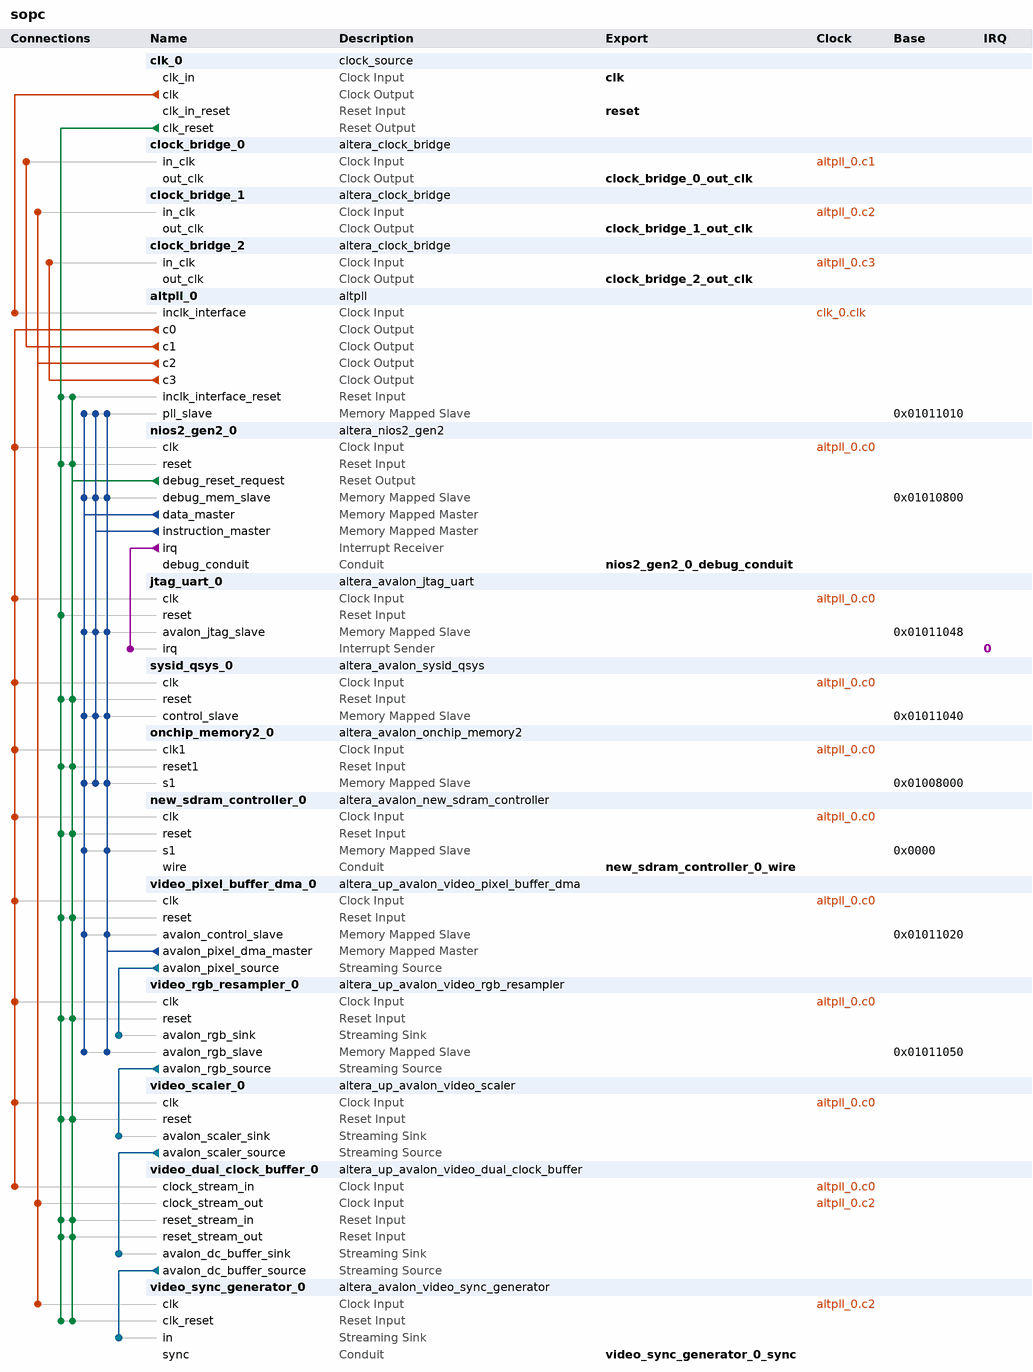
[diagram p0: system contents]
# Platform Designer (Qsys) system sopc, Cyclone 10 LP 10CL025YE144I7G
# Parameters at their usual value, and those the tool derives, are not listed.
package require -exact qsys 18.1
create_system sopc
set_project_property DEVICE_FAMILY {Cyclone 10 LP}
set_project_property DEVICE 10CL025YE144I7G

add_instance clk_0 clock_source 18.1
set_instance_parameter_value clk_0 clockFrequency 50000000
set_instance_parameter_value clk_0 resetSynchronousEdges BOTH

add_instance clock_bridge_0 altera_clock_bridge 18.1
set_instance_parameter_value clock_bridge_0 DERIVED_CLOCK_RATE 120000000
set_instance_parameter_value clock_bridge_0 EXPLICIT_CLOCK_RATE 0

add_instance clock_bridge_1 altera_clock_bridge 18.1
set_instance_parameter_value clock_bridge_1 DERIVED_CLOCK_RATE 40000000
set_instance_parameter_value clock_bridge_1 EXPLICIT_CLOCK_RATE 0

add_instance clock_bridge_2 altera_clock_bridge 18.1
set_instance_parameter_value clock_bridge_2 DERIVED_CLOCK_RATE 200000000
set_instance_parameter_value clock_bridge_2 EXPLICIT_CLOCK_RATE 0

add_instance altpll_0 altpll 18.1
set_instance_parameter_value altpll_0 CLK0_DIVIDE_BY 5
set_instance_parameter_value altpll_0 CLK0_MULTIPLY_BY 12
set_instance_parameter_value altpll_0 CLK1_DIVIDE_BY 5
set_instance_parameter_value altpll_0 CLK1_DUTY_CYCLE 50
set_instance_parameter_value altpll_0 CLK1_MULTIPLY_BY 12
set_instance_parameter_value altpll_0 CLK1_PHASE_SHIFT -1389
set_instance_parameter_value altpll_0 CLK2_DIVIDE_BY 5
set_instance_parameter_value altpll_0 CLK2_DUTY_CYCLE 50
set_instance_parameter_value altpll_0 CLK2_MULTIPLY_BY 4
set_instance_parameter_value altpll_0 CLK2_PHASE_SHIFT 0
set_instance_parameter_value altpll_0 CLK3_DIVIDE_BY 1
set_instance_parameter_value altpll_0 CLK3_DUTY_CYCLE 50
set_instance_parameter_value altpll_0 CLK3_MULTIPLY_BY 4
set_instance_parameter_value altpll_0 CLK3_PHASE_SHIFT 0
set_instance_parameter_value altpll_0 INCLK0_INPUT_FREQUENCY 20000
set_instance_parameter_value altpll_0 PORT_ARESET PORT_UNUSED
set_instance_parameter_value altpll_0 PORT_LOCKED PORT_UNUSED
set_instance_parameter_value altpll_0 PORT_clk1 PORT_USED
set_instance_parameter_value altpll_0 PORT_clk2 PORT_USED
set_instance_parameter_value altpll_0 PORT_clk3 PORT_USED

add_instance nios2_gen2_0 altera_nios2_gen2 18.1
set_instance_parameter_value nios2_gen2_0 dcache_size 0
set_instance_parameter_value nios2_gen2_0 debug_debugReqSignals true
set_instance_parameter_value nios2_gen2_0 exceptionSlave onchip_memory2_0.s1
set_instance_parameter_value nios2_gen2_0 icache_size 0
set_instance_parameter_value nios2_gen2_0 impl Fast
set_instance_parameter_value nios2_gen2_0 mmu_TLBMissExcOffset 64
set_instance_parameter_value nios2_gen2_0 mmu_TLBMissExcSlave nios2_gen2_0.debug_mem_slave
set_instance_parameter_value nios2_gen2_0 mmu_autoAssignTlbPtrSz false
set_instance_parameter_value nios2_gen2_0 resetSlave onchip_memory2_0.s1
set_instance_parameter_value nios2_gen2_0 setting_support31bitdcachebypass false

add_instance jtag_uart_0 altera_avalon_jtag_uart 18.1
set_instance_parameter_value jtag_uart_0 simInteractiveOptions NO_INTERACTIVE_WINDOWS

add_instance sysid_qsys_0 altera_avalon_sysid_qsys 18.1
set_instance_parameter_value sysid_qsys_0 id 305419896

add_instance onchip_memory2_0 altera_avalon_onchip_memory2 18.1
set_instance_parameter_value onchip_memory2_0 dataWidth 32
set_instance_parameter_value onchip_memory2_0 dualPort false
set_instance_parameter_value onchip_memory2_0 initMemContent true
set_instance_parameter_value onchip_memory2_0 initializationFileName onchip_mem.hex
set_instance_parameter_value onchip_memory2_0 memorySize 32000

add_instance new_sdram_controller_0 altera_avalon_new_sdram_controller 18.1
set_instance_parameter_value new_sdram_controller_0 TAC 5.5
set_instance_parameter_value new_sdram_controller_0 TRCD 20.0
set_instance_parameter_value new_sdram_controller_0 TRP 20.0
set_instance_parameter_value new_sdram_controller_0 casLatency 2
set_instance_parameter_value new_sdram_controller_0 columnWidth 10
set_instance_parameter_value new_sdram_controller_0 dataWidth 8
set_instance_parameter_value new_sdram_controller_0 generateSimulationModel false
set_instance_parameter_value new_sdram_controller_0 initRefreshCommands 8
set_instance_parameter_value new_sdram_controller_0 model single_Micron_MT48LC4M32B2_7_chip
set_instance_parameter_value new_sdram_controller_0 numberOfBanks 4
set_instance_parameter_value new_sdram_controller_0 numberOfChipSelects 1
set_instance_parameter_value new_sdram_controller_0 powerUpDelay 200.0
set_instance_parameter_value new_sdram_controller_0 refreshPeriod 7.8125
set_instance_parameter_value new_sdram_controller_0 rowWidth 12

add_instance video_pixel_buffer_dma_0 altera_up_avalon_video_pixel_buffer_dma 18.0
set_instance_parameter_value video_pixel_buffer_dma_0 addr_mode X-Y
set_instance_parameter_value video_pixel_buffer_dma_0 back_start_address 1048576
set_instance_parameter_value video_pixel_buffer_dma_0 color_space {16-bit RGB}
set_instance_parameter_value video_pixel_buffer_dma_0 image_height 300
set_instance_parameter_value video_pixel_buffer_dma_0 image_width 400
set_instance_parameter_value video_pixel_buffer_dma_0 start_address 0

add_instance video_rgb_resampler_0 altera_up_avalon_video_rgb_resampler 18.0
set_instance_parameter_value video_rgb_resampler_0 alpha 255
set_instance_parameter_value video_rgb_resampler_0 input_type {16-bit RGB}
set_instance_parameter_value video_rgb_resampler_0 output_type {8-bit RGB}

add_instance video_scaler_0 altera_up_avalon_video_scaler 18.0
set_instance_parameter_value video_scaler_0 color_bits 8
set_instance_parameter_value video_scaler_0 color_planes 1
set_instance_parameter_value video_scaler_0 height_in 300
set_instance_parameter_value video_scaler_0 height_scaling 2
set_instance_parameter_value video_scaler_0 width_in 400
set_instance_parameter_value video_scaler_0 width_scaling 2

add_instance video_dual_clock_buffer_0 altera_up_avalon_video_dual_clock_buffer 18.0
set_instance_parameter_value video_dual_clock_buffer_0 color_bits 8
set_instance_parameter_value video_dual_clock_buffer_0 color_planes 1

add_instance video_sync_generator_0 altera_avalon_video_sync_generator 18.1
set_instance_parameter_value video_sync_generator_0 BEATS_PER_PIXEL 1
set_instance_parameter_value video_sync_generator_0 DATA_STREAM_BIT_WIDTH 8
set_instance_parameter_value video_sync_generator_0 H_BLANK_PIXELS 0
set_instance_parameter_value video_sync_generator_0 H_FRONT_PORCH_PIXELS 0
set_instance_parameter_value video_sync_generator_0 H_SYNC_PULSE_PIXELS 256
set_instance_parameter_value video_sync_generator_0 H_SYNC_PULSE_POLARITY 0
set_instance_parameter_value video_sync_generator_0 NUM_COLUMNS 800
set_instance_parameter_value video_sync_generator_0 NUM_ROWS 600
set_instance_parameter_value video_sync_generator_0 TOTAL_HSCAN_PIXELS 1056
set_instance_parameter_value video_sync_generator_0 TOTAL_VSCAN_LINES 628
set_instance_parameter_value video_sync_generator_0 V_BLANK_LINES 0
set_instance_parameter_value video_sync_generator_0 V_FRONT_PORCH_LINES 0
set_instance_parameter_value video_sync_generator_0 V_SYNC_PULSE_LINES 28
set_instance_parameter_value video_sync_generator_0 V_SYNC_PULSE_POLARITY 0

# connections
add_connection altpll_0.c0 jtag_uart_0.clk clock
add_connection altpll_0.c0 new_sdram_controller_0.clk clock
add_connection altpll_0.c0 nios2_gen2_0.clk clock
add_connection altpll_0.c0 onchip_memory2_0.clk1 clock
add_connection altpll_0.c0 sysid_qsys_0.clk clock
add_connection altpll_0.c0 video_dual_clock_buffer_0.clock_stream_in clock
add_connection altpll_0.c0 video_pixel_buffer_dma_0.clk clock
add_connection altpll_0.c0 video_rgb_resampler_0.clk clock
add_connection altpll_0.c0 video_scaler_0.clk clock
add_connection altpll_0.c1 clock_bridge_0.in_clk clock
add_connection altpll_0.c2 clock_bridge_1.in_clk clock
add_connection altpll_0.c2 video_dual_clock_buffer_0.clock_stream_out clock
add_connection altpll_0.c2 video_sync_generator_0.clk clock
add_connection altpll_0.c3 clock_bridge_2.in_clk clock
add_connection clk_0.clk altpll_0.inclk_interface clock
add_connection clk_0.clk_reset altpll_0.inclk_interface_reset reset
add_connection clk_0.clk_reset jtag_uart_0.reset reset
add_connection clk_0.clk_reset new_sdram_controller_0.reset reset
add_connection clk_0.clk_reset nios2_gen2_0.reset reset
add_connection clk_0.clk_reset onchip_memory2_0.reset1 reset
add_connection clk_0.clk_reset sysid_qsys_0.reset reset
add_connection clk_0.clk_reset video_dual_clock_buffer_0.reset_stream_in reset
add_connection clk_0.clk_reset video_dual_clock_buffer_0.reset_stream_out reset
add_connection clk_0.clk_reset video_pixel_buffer_dma_0.reset reset
add_connection clk_0.clk_reset video_rgb_resampler_0.reset reset
add_connection clk_0.clk_reset video_scaler_0.reset reset
add_connection clk_0.clk_reset video_sync_generator_0.clk_reset reset
add_connection nios2_gen2_0.debug_reset_request altpll_0.inclk_interface_reset reset
add_connection nios2_gen2_0.debug_reset_request new_sdram_controller_0.reset reset
add_connection nios2_gen2_0.debug_reset_request nios2_gen2_0.reset reset
add_connection nios2_gen2_0.debug_reset_request onchip_memory2_0.reset1 reset
add_connection nios2_gen2_0.debug_reset_request sysid_qsys_0.reset reset
add_connection nios2_gen2_0.debug_reset_request video_dual_clock_buffer_0.reset_stream_in reset
add_connection nios2_gen2_0.debug_reset_request video_dual_clock_buffer_0.reset_stream_out reset
add_connection nios2_gen2_0.debug_reset_request video_pixel_buffer_dma_0.reset reset
add_connection nios2_gen2_0.debug_reset_request video_rgb_resampler_0.reset reset
add_connection nios2_gen2_0.debug_reset_request video_scaler_0.reset reset
add_connection nios2_gen2_0.debug_reset_request video_sync_generator_0.clk_reset reset
add_connection nios2_gen2_0.data_master altpll_0.pll_slave avalon
set_connection_parameter_value nios2_gen2_0.data_master/altpll_0.pll_slave baseAddress 0x01011010
add_connection nios2_gen2_0.data_master jtag_uart_0.avalon_jtag_slave avalon
set_connection_parameter_value nios2_gen2_0.data_master/jtag_uart_0.avalon_jtag_slave baseAddress 0x01011048
add_connection nios2_gen2_0.data_master new_sdram_controller_0.s1 avalon
set_connection_parameter_value nios2_gen2_0.data_master/new_sdram_controller_0.s1 baseAddress 0x0000
add_connection nios2_gen2_0.data_master nios2_gen2_0.debug_mem_slave avalon
set_connection_parameter_value nios2_gen2_0.data_master/nios2_gen2_0.debug_mem_slave baseAddress 0x01010800
add_connection nios2_gen2_0.data_master onchip_memory2_0.s1 avalon
set_connection_parameter_value nios2_gen2_0.data_master/onchip_memory2_0.s1 baseAddress 0x01008000
add_connection nios2_gen2_0.data_master sysid_qsys_0.control_slave avalon
set_connection_parameter_value nios2_gen2_0.data_master/sysid_qsys_0.control_slave baseAddress 0x01011040
add_connection nios2_gen2_0.data_master video_pixel_buffer_dma_0.avalon_control_slave avalon
set_connection_parameter_value nios2_gen2_0.data_master/video_pixel_buffer_dma_0.avalon_control_slave baseAddress 0x01011020
add_connection nios2_gen2_0.data_master video_rgb_resampler_0.avalon_rgb_slave avalon
set_connection_parameter_value nios2_gen2_0.data_master/video_rgb_resampler_0.avalon_rgb_slave baseAddress 0x01011050
add_connection nios2_gen2_0.instruction_master altpll_0.pll_slave avalon
set_connection_parameter_value nios2_gen2_0.instruction_master/altpll_0.pll_slave baseAddress 0x01011010
add_connection nios2_gen2_0.instruction_master jtag_uart_0.avalon_jtag_slave avalon
set_connection_parameter_value nios2_gen2_0.instruction_master/jtag_uart_0.avalon_jtag_slave baseAddress 0x01011048
add_connection nios2_gen2_0.instruction_master nios2_gen2_0.debug_mem_slave avalon
set_connection_parameter_value nios2_gen2_0.instruction_master/nios2_gen2_0.debug_mem_slave baseAddress 0x01010800
add_connection nios2_gen2_0.instruction_master onchip_memory2_0.s1 avalon
set_connection_parameter_value nios2_gen2_0.instruction_master/onchip_memory2_0.s1 baseAddress 0x01008000
add_connection nios2_gen2_0.instruction_master sysid_qsys_0.control_slave avalon
set_connection_parameter_value nios2_gen2_0.instruction_master/sysid_qsys_0.control_slave baseAddress 0x01011040
add_connection video_pixel_buffer_dma_0.avalon_pixel_dma_master altpll_0.pll_slave avalon
set_connection_parameter_value video_pixel_buffer_dma_0.avalon_pixel_dma_master/altpll_0.pll_slave baseAddress 0x01011010
add_connection video_pixel_buffer_dma_0.avalon_pixel_dma_master jtag_uart_0.avalon_jtag_slave avalon
set_connection_parameter_value video_pixel_buffer_dma_0.avalon_pixel_dma_master/jtag_uart_0.avalon_jtag_slave baseAddress 0x01011048
add_connection video_pixel_buffer_dma_0.avalon_pixel_dma_master new_sdram_controller_0.s1 avalon
set_connection_parameter_value video_pixel_buffer_dma_0.avalon_pixel_dma_master/new_sdram_controller_0.s1 baseAddress 0x0000
add_connection video_pixel_buffer_dma_0.avalon_pixel_dma_master nios2_gen2_0.debug_mem_slave avalon
set_connection_parameter_value video_pixel_buffer_dma_0.avalon_pixel_dma_master/nios2_gen2_0.debug_mem_slave baseAddress 0x01010800
add_connection video_pixel_buffer_dma_0.avalon_pixel_dma_master onchip_memory2_0.s1 avalon
set_connection_parameter_value video_pixel_buffer_dma_0.avalon_pixel_dma_master/onchip_memory2_0.s1 baseAddress 0x01008000
add_connection video_pixel_buffer_dma_0.avalon_pixel_dma_master sysid_qsys_0.control_slave avalon
set_connection_parameter_value video_pixel_buffer_dma_0.avalon_pixel_dma_master/sysid_qsys_0.control_slave baseAddress 0x01011040
add_connection video_pixel_buffer_dma_0.avalon_pixel_dma_master video_pixel_buffer_dma_0.avalon_control_slave avalon
set_connection_parameter_value video_pixel_buffer_dma_0.avalon_pixel_dma_master/video_pixel_buffer_dma_0.avalon_control_slave baseAddress 0x01011020
add_connection video_pixel_buffer_dma_0.avalon_pixel_dma_master video_rgb_resampler_0.avalon_rgb_slave avalon
set_connection_parameter_value video_pixel_buffer_dma_0.avalon_pixel_dma_master/video_rgb_resampler_0.avalon_rgb_slave baseAddress 0x01011050
add_connection video_dual_clock_buffer_0.avalon_dc_buffer_source video_sync_generator_0.in avalon_streaming
add_connection video_pixel_buffer_dma_0.avalon_pixel_source video_rgb_resampler_0.avalon_rgb_sink avalon_streaming
add_connection video_rgb_resampler_0.avalon_rgb_source video_scaler_0.avalon_scaler_sink avalon_streaming
add_connection video_scaler_0.avalon_scaler_source video_dual_clock_buffer_0.avalon_dc_buffer_sink avalon_streaming
add_connection nios2_gen2_0.irq jtag_uart_0.irq interrupt
set_connection_parameter_value nios2_gen2_0.irq/jtag_uart_0.irq irqNumber 0

# exported interfaces
add_interface clk clock sink
set_interface_property clk EXPORT_OF clk_0.clk_in
add_interface clock_bridge_0_out_clk clock source
set_interface_property clock_bridge_0_out_clk EXPORT_OF clock_bridge_0.out_clk
add_interface clock_bridge_1_out_clk clock source
set_interface_property clock_bridge_1_out_clk EXPORT_OF clock_bridge_1.out_clk
add_interface clock_bridge_2_out_clk clock source
set_interface_property clock_bridge_2_out_clk EXPORT_OF clock_bridge_2.out_clk
add_interface new_sdram_controller_0_wire conduit end
set_interface_property new_sdram_controller_0_wire EXPORT_OF new_sdram_controller_0.wire
add_interface nios2_gen2_0_debug_conduit conduit end
set_interface_property nios2_gen2_0_debug_conduit EXPORT_OF nios2_gen2_0.debug_conduit
add_interface reset reset sink
set_interface_property reset EXPORT_OF clk_0.clk_in_reset
add_interface video_sync_generator_0_sync conduit end
set_interface_property video_sync_generator_0_sync EXPORT_OF video_sync_generator_0.sync

set_interconnect_requirement {$system} qsys_mm.clockCrossingAdapter HANDSHAKE
set_interconnect_requirement {$system} qsys_mm.enableEccProtection FALSE
set_interconnect_requirement {$system} qsys_mm.insertDefaultSlave FALSE
set_interconnect_requirement {$system} qsys_mm.maxAdditionalLatency 1

save_system sopc.qsys
